# EAGLE design bufferedBackplane (EAGLE 6.6.0)
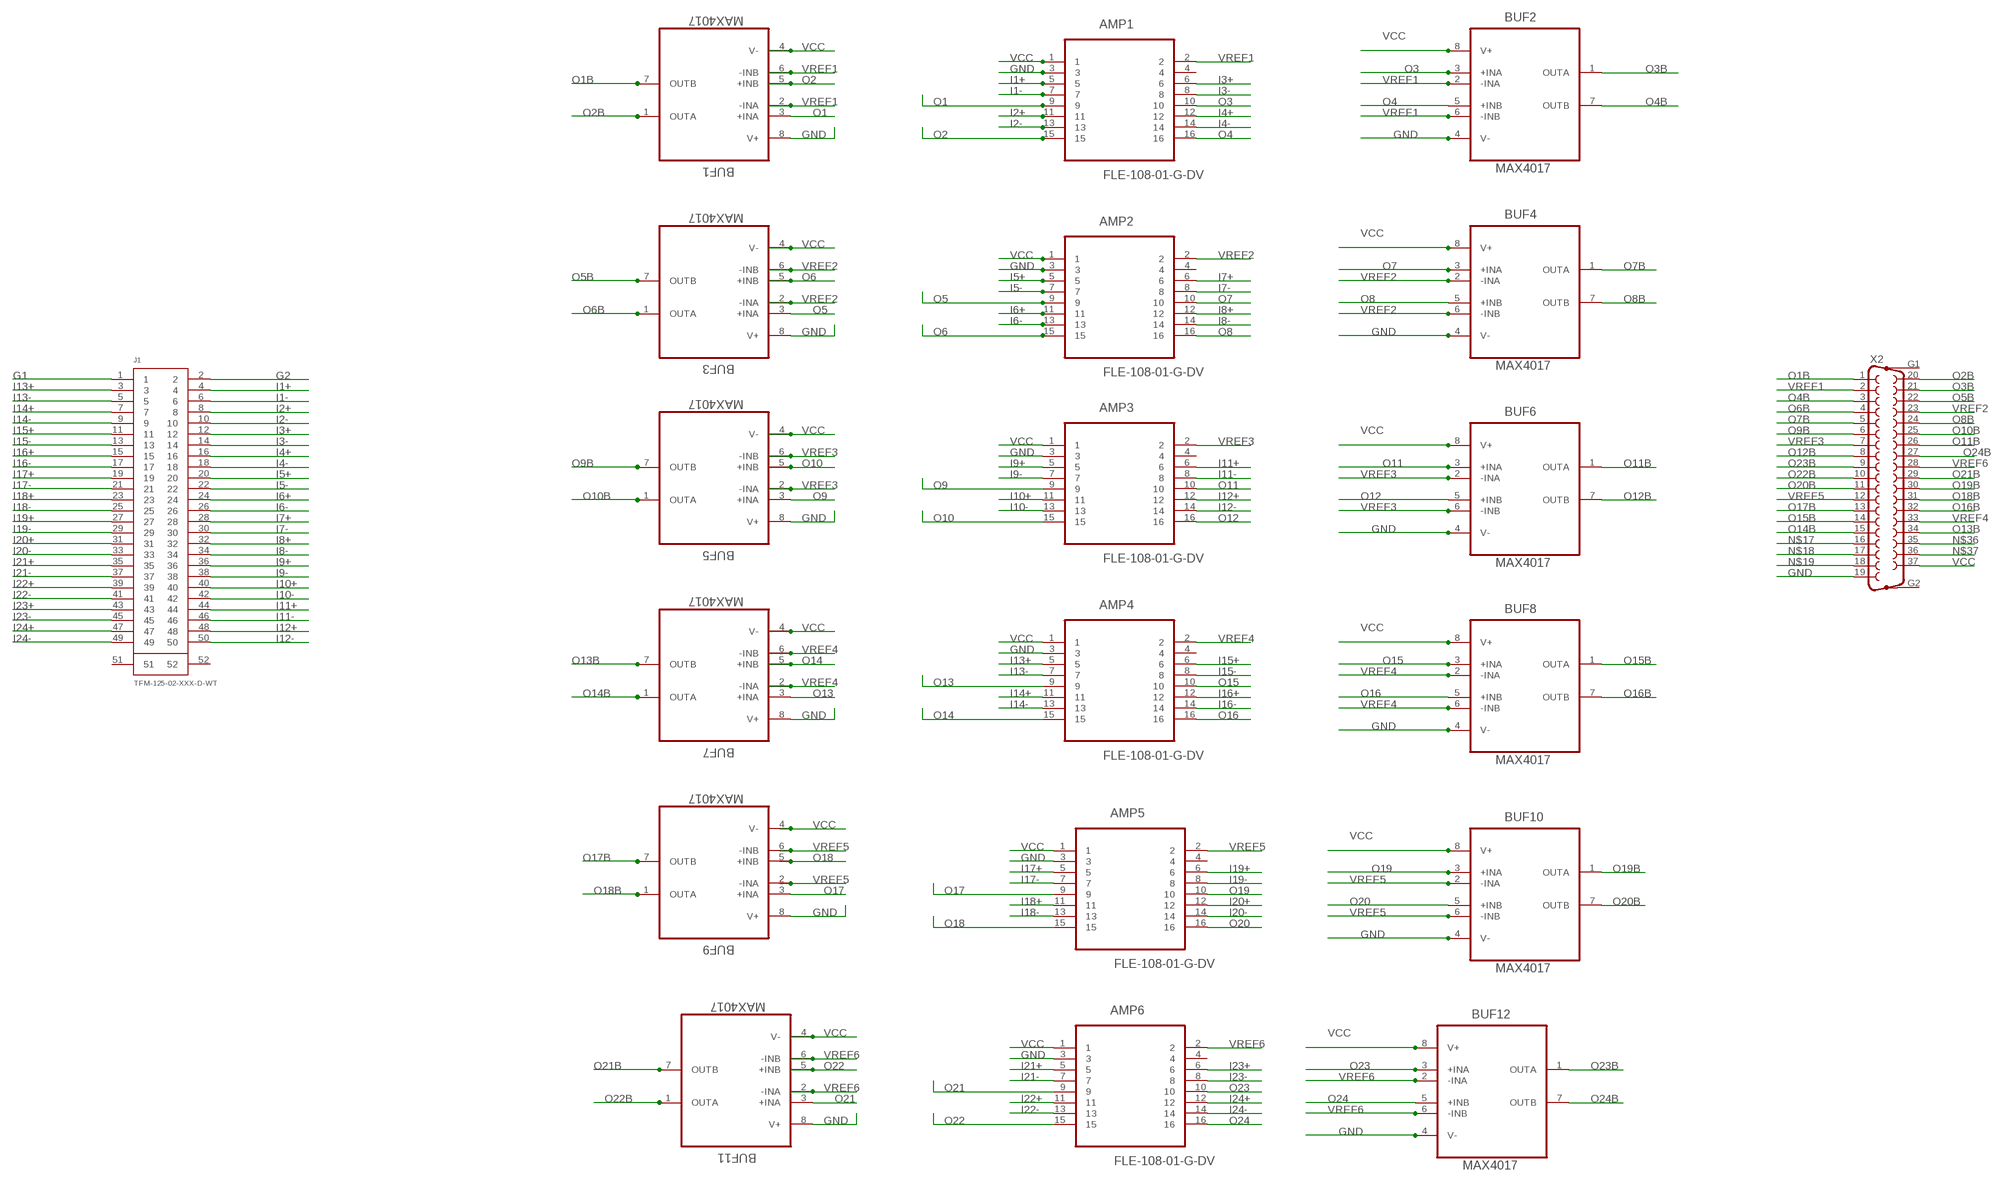
[diagram p0: schematic, sheet 1]

## Parts
AMP1  FLE-108-01-G-DV  [SAMTEC_FLE-108-01-G-DV]
AMP2  FLE-108-01-G-DV  [SAMTEC_FLE-108-01-G-DV]
AMP3  FLE-108-01-G-DV  [SAMTEC_FLE-108-01-G-DV]
AMP4  FLE-108-01-G-DV  [SAMTEC_FLE-108-01-G-DV]
AMP5  FLE-108-01-G-DV  [SAMTEC_FLE-108-01-G-DV]
AMP6  FLE-108-01-G-DV  [SAMTEC_FLE-108-01-G-DV]
BUF1  MAX4017  [MAX4017]
BUF2  MAX4017  [MAX4017]
BUF3  MAX4017  [MAX4017]
BUF4  MAX4017  [MAX4017]
BUF5  MAX4017  [MAX4017]
BUF6  MAX4017  [MAX4017]
BUF7  MAX4017  [MAX4017]
BUF8  MAX4017  [MAX4017]
BUF9  MAX4017  [MAX4017]
BUF10  MAX4017  [MAX4017]
BUF11  MAX4017  [MAX4017]
BUF12  MAX4017  [MAX4017]
J1  TFM-125-02-XXX-D-WT  [TFM-125-02-XXX-D-WT]
X2  F37HP  [F37HP]

## Nets
G1: J1.1
G2: J1.2
GND: AMP1.3 AMP2.3 AMP3.3 AMP4.3 AMP5.3 AMP6.3 BUF1.8(V+) BUF2.4(V-) BUF3.8(V+) BUF4.4(V-) BUF5.8(V+) BUF6.4(V-) BUF7.8(V+) BUF8.4(V-) BUF9.8(V+) BUF10.4(V-) BUF11.8(V+) BUF12.4(V-) X2.19
I1+: AMP1.5 J1.4
I1-: AMP1.7 J1.6
I2+: AMP1.11 J1.8
I2-: AMP1.13 J1.10
I3+: AMP1.6 J1.12
I3-: AMP1.8 J1.14
I4+: AMP1.12 J1.16
I4-: AMP1.14 J1.18
I5+: AMP2.5 J1.20
I5-: AMP2.7 J1.22
I6+: AMP2.11 J1.24
I6-: AMP2.13 J1.26
I7+: AMP2.6 J1.28
I7-: AMP2.8 J1.30
I8+: AMP2.12 J1.32
I8-: AMP2.14 J1.34
I9+: AMP3.5 J1.36
I9-: AMP3.7 J1.38
I10+: AMP3.11 J1.40
I10-: AMP3.13 J1.42
I11+: AMP3.6 J1.44
I11-: AMP3.8 J1.46
I12+: AMP3.12 J1.48
I12-: AMP3.14 J1.50
I13+: AMP4.5 J1.3
I13-: AMP4.7 J1.5
I14+: AMP4.11 J1.7
I14-: AMP4.13 J1.9
I15+: AMP4.6 J1.11
I15-: AMP4.8 J1.13
I16+: AMP4.12 J1.15
I16-: AMP4.14 J1.17
I17+: AMP5.5 J1.19
I17-: AMP5.7 J1.21
I18+: AMP5.11 J1.23
I18-: AMP5.13 J1.25
I19+: AMP5.6 J1.27
I19-: AMP5.8 J1.29
I20+: AMP5.12 J1.31
I20-: AMP5.14 J1.33
I21+: AMP6.5 J1.35
I21-: AMP6.7 J1.37
I22+: AMP6.11 J1.39
I22-: AMP6.13 J1.41
I23+: AMP6.6 J1.43
I23-: AMP6.8 J1.45
I24+: AMP6.12 J1.47
I24-: AMP6.14 J1.49
N$17: X2.16
N$18: X2.17
N$19: X2.18
N$36: X2.35
N$37: X2.36
O1: AMP1.9 BUF1.3(+INA)
O1B: BUF1.7(OUTB) X2.1
O2: AMP1.15 BUF1.5(+INB)
O2B: BUF1.1(OUTA) X2.20
O3: AMP1.10 BUF2.3(+INA)
O3B: BUF2.1(OUTA) X2.21
O4: AMP1.16 BUF2.5(+INB)
O4B: BUF2.7(OUTB) X2.3
O5: AMP2.9 BUF3.3(+INA)
O5B: BUF3.7(OUTB) X2.22
O6: AMP2.15 BUF3.5(+INB)
O6B: BUF3.1(OUTA) X2.4
O7: AMP2.10 BUF4.3(+INA)
O7B: BUF4.1(OUTA) X2.5
O8: AMP2.16 BUF4.5(+INB)
O8B: BUF4.7(OUTB) X2.24
O9: AMP3.9 BUF5.3(+INA)
O9B: BUF5.7(OUTB) X2.6
O10: AMP3.15 BUF5.5(+INB)
O10B: BUF5.1(OUTA) X2.25
O11: AMP3.10 BUF6.3(+INA)
O11B: BUF6.1(OUTA) X2.26
O12: AMP3.16 BUF6.5(+INB)
O12B: BUF6.7(OUTB) X2.8
O13: AMP4.9 BUF7.3(+INA)
O13B: BUF7.7(OUTB) X2.34
O14: AMP4.15 BUF7.5(+INB)
O14B: BUF7.1(OUTA) X2.15
O15: AMP4.10 BUF8.3(+INA)
O15B: BUF8.1(OUTA) X2.14
O16: AMP4.16 BUF8.5(+INB)
O16B: BUF8.7(OUTB) X2.32
O17: AMP5.9 BUF9.3(+INA)
O17B: BUF9.7(OUTB) X2.13
O18: AMP5.15 BUF9.5(+INB)
O18B: BUF9.1(OUTA) X2.31
O19: AMP5.10 BUF10.3(+INA)
O19B: BUF10.1(OUTA) X2.30
O20: AMP5.16 BUF10.5(+INB)
O20B: BUF10.7(OUTB) X2.11
O21: AMP6.9 BUF11.3(+INA)
O21B: BUF11.7(OUTB) X2.29
O22: AMP6.15 BUF11.5(+INB)
O22B: BUF11.1(OUTA) X2.10
O23: AMP6.10 BUF12.3(+INA)
O23B: BUF12.1(OUTA) X2.9
O24: AMP6.16 BUF12.5(+INB)
O24B: BUF12.7(OUTB) X2.27
VCC: AMP1.1 AMP2.1 AMP3.1 AMP4.1 AMP5.1 AMP6.1 BUF1.4(V-) BUF2.8(V+) BUF3.4(V-) BUF4.8(V+) BUF5.4(V-) BUF6.8(V+) BUF7.4(V-) BUF8.8(V+) BUF9.4(V-) BUF10.8(V+) BUF11.4(V-) BUF12.8(V+) X2.37
VREF1: AMP1.2 BUF1.2(-INA) BUF1.6(-INB) BUF2.2(-INA) BUF2.6(-INB) X2.2
VREF2: AMP2.2 BUF3.2(-INA) BUF3.6(-INB) BUF4.2(-INA) BUF4.6(-INB) X2.23
VREF3: AMP3.2 BUF5.2(-INA) BUF5.6(-INB) BUF6.2(-INA) BUF6.6(-INB) X2.7
VREF4: AMP4.2 BUF7.2(-INA) BUF7.6(-INB) BUF8.2(-INA) BUF8.6(-INB) X2.33
VREF5: AMP5.2 BUF9.2(-INA) BUF9.6(-INB) BUF10.2(-INA) BUF10.6(-INB) X2.12
VREF6: AMP6.2 BUF11.2(-INA) BUF11.6(-INB) BUF12.2(-INA) BUF12.6(-INB) X2.28
Unconnected: AMP1.4 AMP2.4 AMP3.4 AMP4.4 AMP5.4 AMP6.4 J1.51 J1.52 X2.G1 X2.G2

## Library data of the parts
AMP1-AMP6 = SAMTEC-FLE-Mxx-Sxx_By_element14_Batch_1:FLE-108-01-G-DV: CONN SOCKET, 1.27MM, SMT, 16WAY; MPN: FLE-108-01-G-DV; OC_FARNELL: 1929625; OC_NEWARK: 26K2845; PACKAGE: SOCKET, 1.27MM, SMT, 16WAY; SUPPLIER: SAMTEC
BUF1-BUF12 = tuckerLib:MAX4017
J1 = TFM-125-02-XXX-D-WT:TFM-125-02-XXX-D-WT: 0.050"X0.050" SURFACE MOUNT TERMINAL STRIP WITH DUAL WELD TAB.
X2 = con-subd:F37HP: SUB-D; OC_FARNELL: unknown; OC_NEWARK: unknown

## Board
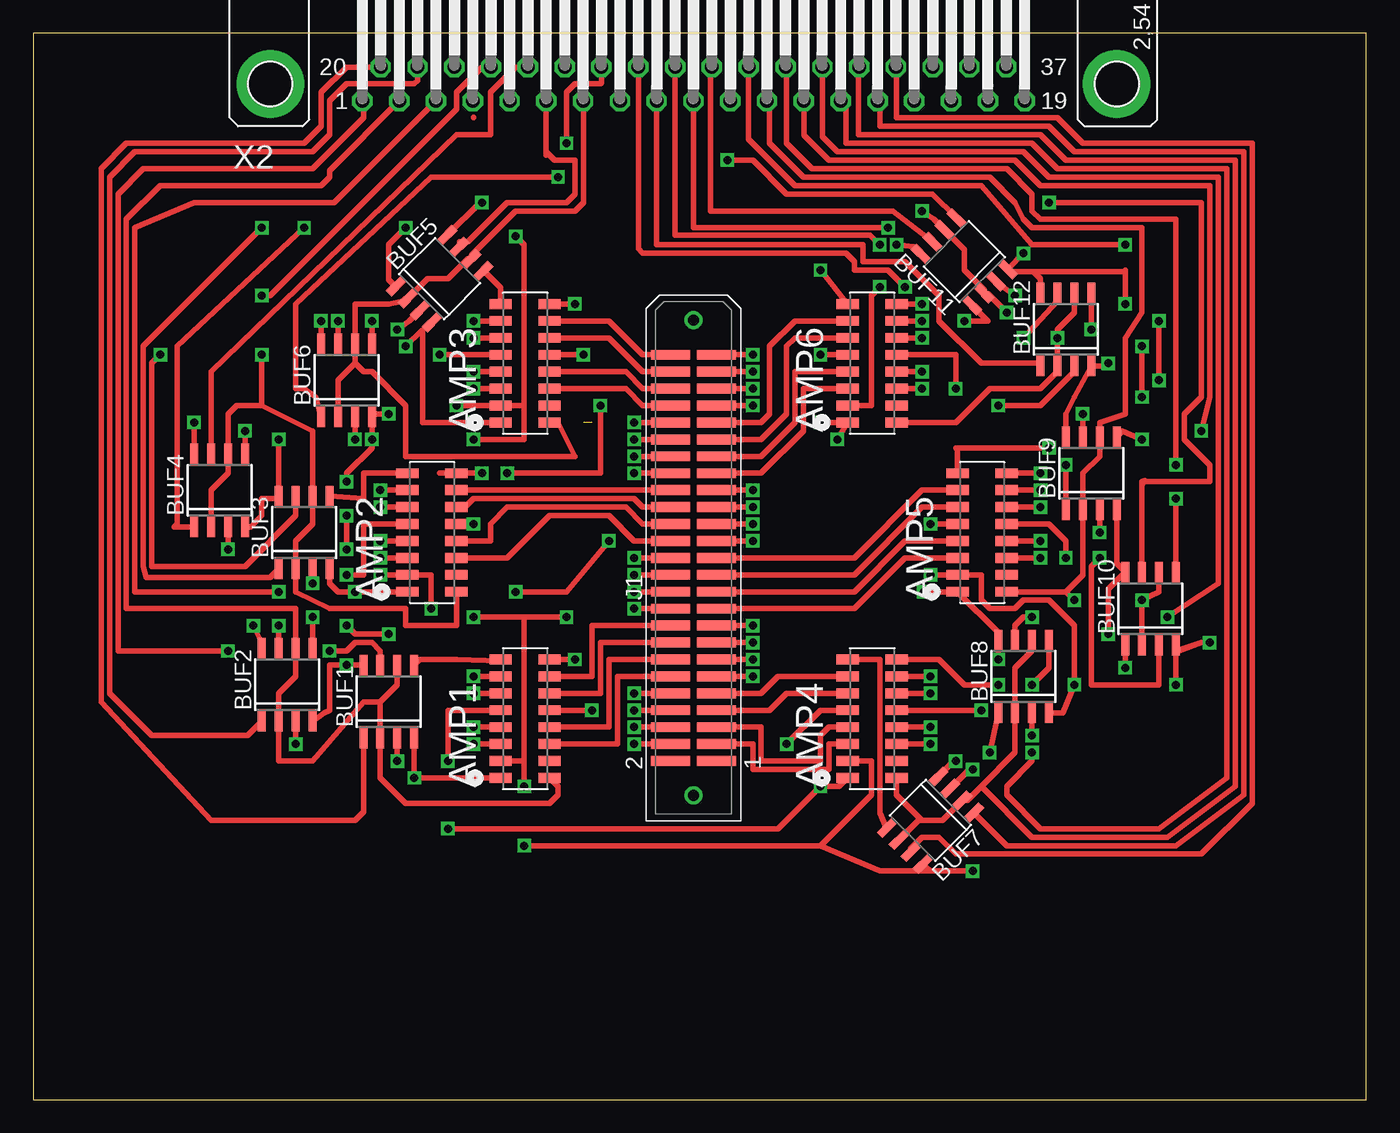
[diagram p1: board, top side]
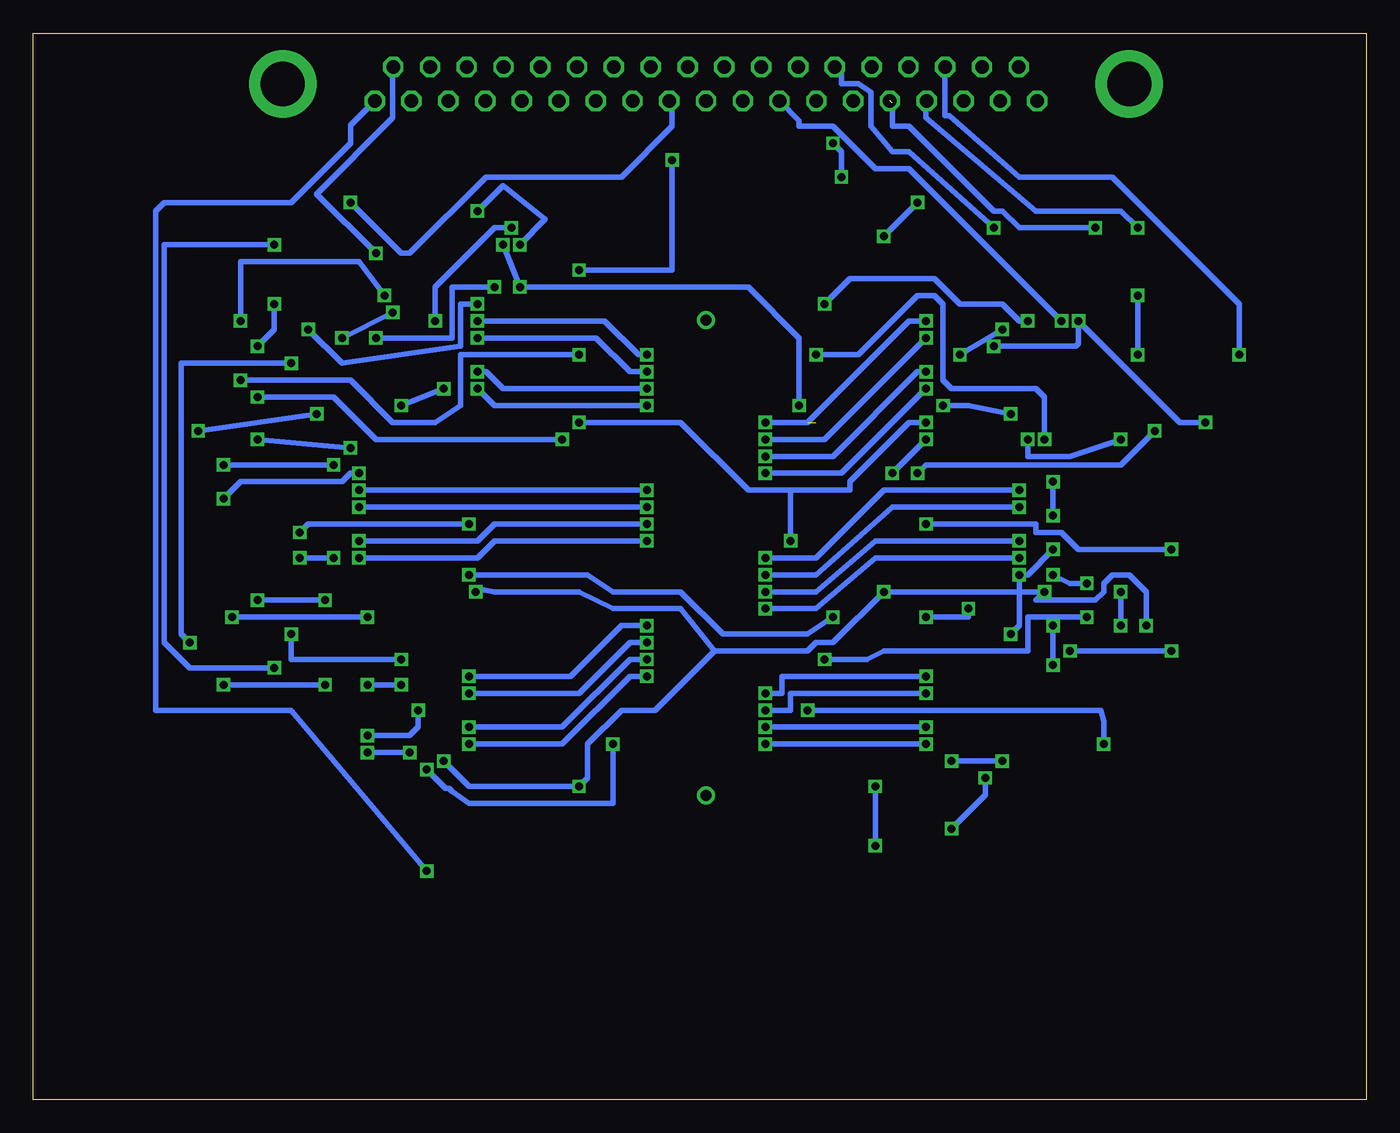
[diagram p2: board, bottom side, seen from below]

Size 100 x 80 mm. Coordinates in mm from the lower left corner, seen from the top.
Outline: 0,0 100,0 100,80 0,80 0,0
Copper layers (1*16): Top 0.035mm / dielectric 1.5mm / Bottom 0.035mm
Design rules "default": minimum track width 10mil, minimum drill 24mil, track to track 8mil, track to pad 8mil, pad to pad 8mil, via to via 8mil, smd to smd 8mil, copper to edge 40mil, drill to drill 8mil, minimum pad ring 10mil, minimum via ring 8mil, stop-mask expansion 4mil, vias tented up to drill 0mil, thermal gap 10mil

### Footprints (pad centres in the part's own frame; a part is rotated, then mirrored left to right if it is on the bottom)
SAMTEC_FLE-108-01-G-DV = smd 0.737 x 1.676: 1 -8.89,3.683; 2 -8.89,0; 3 -7.62,3.683; 4 -7.62,0; 5 -6.35,3.683; 6 -6.35,0; 7 -5.08,3.683; 8 -5.08,0; 9 -3.81,3.683; 10 -3.81,0; 11 -2.54,3.683; 12 -2.54,0; 13 -1.27,3.683; 14 -1.27,0; 15 0,3.683; 16 0,0
MAX4017 = smd 0.6 x 1.5: 1 -1.905,-2.75; 2 -0.635,-2.75; 3 0.635,-2.75; 4 1.905,-2.75; 5 1.905,2.75; 6 0.635,2.75; 7 -0.635,2.75; 8 -1.905,2.75
TFM-125-02-XXX-D-WT = smd 0.737 x 2.921: 1 -15.24,-1.714; 2 -15.24,1.714; 3 -13.97,-1.714; 4 -13.97,1.714; 5 -12.7,-1.714; 6 -12.7,1.714; 7 -11.43,-1.714; 8 -11.43,1.714; 9 -10.16,-1.714; 10 -10.16,1.714; 11 -8.89,-1.714; 12 -8.89,1.714; 13 -7.62,-1.714; 14 -7.62,1.714; 15 -6.35,-1.714; 16 -6.35,1.714; 17 -5.08,-1.714; 18 -5.08,1.714; 19 -3.81,-1.714; 20 -3.81,1.714; 21 -2.54,-1.714; 22 -2.54,1.714; 23 -1.27,-1.714; 24 -1.27,1.714; 25 0,-1.714; 26 0,1.714; 27 1.27,-1.714; 28 1.27,1.714; 29 2.54,-1.714; 30 2.54,1.714; 31 3.81,-1.714; 32 3.81,1.714; 33 5.08,-1.714; 34 5.08,1.714; 35 6.35,-1.714; 36 6.35,1.714; 37 7.62,-1.714; 38 7.62,1.714; 39 8.89,-1.714; 40 8.89,1.714; 41 10.16,-1.714; 42 10.16,1.714; 43 11.43,-1.714; 44 11.43,1.714; 45 12.7,-1.714; 46 12.7,1.714; 47 13.97,-1.714; 48 13.97,1.714; 49 15.24,-1.714; 50 15.24,1.714 | drill 0.838: 51 -17.831,0; 52 17.831,0
F37HP = drill 1.016 octagon: 1 -24.841,-1.27; 2 -22.073,-1.27; 3 -19.329,-1.27; 4 -16.561,-1.27; 5 -13.792,-1.27; 6 -11.049,-1.27; 7 -8.28,-1.27; 8 -5.512,-1.27; 9 -2.769,-1.27; 10 0,-1.27; 11 2.769,-1.27; 12 5.512,-1.27; 13 8.28,-1.27; 14 11.049,-1.27; 15 13.818,-1.27; 16 16.561,-1.27; 17 19.329,-1.27; 18 22.098,-1.27; 19 24.841,-1.27; 20 -23.47,1.27; 21 -20.701,1.27; 22 -17.932,1.27; 23 -15.189,1.27; 24 -12.421,1.27; 25 -9.652,1.27; 26 -6.909,1.27; 27 -4.14,1.27; 28 -1.372,1.27; 29 1.372,1.27; 30 4.14,1.27; 31 6.909,1.27; 32 9.677,1.27; 33 12.421,1.27; 34 15.189,1.27; 35 17.958,1.27; 36 20.701,1.27; 37 23.47,1.27 | drill 3.302 pad 5.08: G1 -31.75,0; G2 31.75,0

### Placement (x,y rotation side)
AMP1  38.73,33.02 90 top
AMP2  31.75,46.99 90 top
AMP3  38.73,59.69 90 top
AMP4  64.77,33.02 90 top
AMP5  73.03,46.99 90 top
AMP6  64.77,59.69 90 top
BUF1  26.67,29.84 0 top
BUF2  19.05,31.11 0 top
BUF3  20.32,42.55 0 top
BUF4  13.97,45.72 0 top
BUF5  30.48,61.59 315 top
BUF6  23.5,53.98 0 top
BUF7  67.31,20.95 135 top
BUF8  74.3,31.75 0 top
BUF9  79.38,46.99 0 top
BUF10  83.82,36.83 0 top
BUF11  69.85,62.87 45 top
BUF12  77.47,57.78 0 top
J1  49.53,40.64 90 top
X2  49.53,76.2 0 top

### Tracks (layer width: path | path; a pad name or v marks a point on that pad's centre or on a via)
GND  (via drill 0.6)
  Top 0.406: v31.75,52.07 AMP3.3 36.83,52.07 | v26.67,51.44 25.61,51.44 BUF6.4 v25.4,49.53 25.4,48.9 23.5,46.99 v23.5,46.35 | BUF7.8 67.31,17.14 v70.48,17.14 63.5,17.14 59.05,19.05 | BUF2.4 21.8,29 22.23,29.21 22.23,32.59 v23.5,32.59 BUF1.8 | 36.83,52.07 36.83,64.14 v36.2,64.77 | v33.66,67.31 33.5,67.31 BUF5.8 | BUF4.4 16.3,42.97 17.14,43.81 17.14,45.09 18.2,45.09 BUF3.8 v18.41,49.53 | AMP6.3 62.87,52.07 62.87,60.33 v63.5,60.96 | v64.77,64.14 66.04,63.98 BUF11.8 | 36.83,52.07 36.83,49.53 v33.02,49.53 | v35.56,46.99 42.55,46.99 v42.55,52.07 | v67.31,39.37 AMP5.3 71.12,39.37 71.12,37.47 71.75,36.83 73.66,36.83 74.3,37.47 76.2,37.47 78.11,35.56 v78.11,31.11 77.26,29 BUF8.4 | v40.01,36.2 36.83,36.2 | 36.83,36.2 36.83,25.4 | 36.83,25.4 AMP1.3 | 36.83,36.2 v33.02,36.2 | v29.84,36.83 29.84,39.37 AMP2.3 v26.04,39.37 | v26.67,34.92 24.13,34.92 v23.5,35.56 | 36.83,25.4 v36.83,23.5 | v36.83,19.05 59.05,19.05 | 59.05,19.05 62.87,22.86 62.87,25.4 AMP4.3 | v88.27,34.29 87.63,34.29 | 87.63,34.29 85.94,33.66 BUF10.4 85.72,33.66 | v85.72,31.11 85.72,33.66 | 85.72,33.66 87.63,34.29 | BUF9.8 77.47,51.44 78.11,52.7 BUF12.4 80.22,55.03 v80.64,55.24 | v23.5,41.27 v23.5,43.81
  Bottom 0.406: v31.75,52.07 29.84,52.07 v26.67,51.44 | v70.48,17.14 80.64,29.21 90.81,29.21 90.81,66.67 90.17,67.31 80.64,67.31 76.2,71.75 76.2,73.1 X2.19 | v36.2,64.77 v33.66,67.31 | v18.41,49.53 22.23,48.26 25.4,48.26 v25.4,49.53 | v64.77,64.14 v63.5,60.96 46.35,60.96 42.55,57.15 v42.55,52.07 | v33.02,49.53 v35.56,46.99 | v67.31,39.37 58.42,39.37 56.52,38.1 51.44,38.1 48.26,34.92 41.91,34.92 v40.01,36.2 | v33.02,36.2 29.84,36.2 v29.84,36.83 | v26.67,34.92 26.04,35.56 v26.04,39.37 25.4,39.37 v23.5,41.27 | v23.5,35.56 v23.5,32.59 | v36.83,23.5 v36.83,19.05 | v88.27,34.29 88.9,34.92 88.9,55.24 v80.64,55.24 | v78.11,31.11 v85.72,31.11 | v23.5,43.81 v23.5,46.35
I1+  (via drill 0.6)
  Top 0.406: J1.4 v45.09,26.67 | v33.02,26.67 AMP1.5
  Bottom 0.406: v45.09,26.67 v33.02,26.67
I1-  (via drill 0.6)
  Top 0.406: J1.6 v45.09,27.94 | v33.02,27.94 AMP1.7
  Bottom 0.406: v45.09,27.94 v33.02,27.94
I2+  (via drill 0.6)
  Top 0.406: J1.8 v45.09,29.21 | AMP1.11 v33.02,30.48
  Bottom 0.406: v45.09,29.21 43.18,29.21 43.18,30.48 v33.02,30.48
I2-  (via drill 0.6)
  Top 0.406: J1.10 v45.09,30.48 | v33.02,31.75 AMP1.13
  Bottom 0.406: v45.09,30.48 43.81,30.48 43.81,31.75 v33.02,31.75
I3+
  Top 0.406: J1.12 43.81,31.75 43.81,26.67 AMP1.6
I3-
  Top 0.406: J1.14 43.18,33.02 43.18,27.94 AMP1.8
I4+
  Top 0.406: J1.16 42.55,34.29 42.55,30.48 AMP1.12
I4-
  Top 0.406: J1.18 41.91,35.56 41.91,31.75 AMP1.14
I5+  (via drill 0.6)
  Top 0.406: J1.20 v45.09,36.83 | v26.04,40.64 AMP2.5
  Bottom 0.406: v45.09,36.83 41.27,36.83 36.83,40.64 v26.04,40.64
I5-  (via drill 0.6)
  Top 0.406: J1.22 v45.09,38.1 | v26.04,41.91 AMP2.7
  Bottom 0.406: v45.09,38.1 41.27,38.1 36.83,41.91 v26.04,41.91
I6+  (via drill 0.6)
  Top 0.406: J1.24 v45.09,39.37 | v26.04,44.45 AMP2.11
  Bottom 0.406: v45.09,39.37 41.27,39.37 35.56,44.45 v26.04,44.45
I6-  (via drill 0.6)
  Top 0.406: J1.26 v45.09,40.64 | v26.04,45.72 AMP2.13
  Bottom 0.406: v45.09,40.64 41.27,40.64 36.2,45.72 v26.04,45.72
I7+
  Top 0.406: AMP2.6 35.56,40.64 38.73,43.81 43.18,43.81 45.09,41.91 J1.28
I7-
  Top 0.406: AMP2.8 34.29,41.91 34.29,43.18 35.56,44.45 44.45,44.45 45.72,43.18 J1.30
I8+
  Top 0.406: AMP2.12 32.38,44.45 33.02,45.09 45.09,45.09 45.72,44.45 J1.32
I8-
  Top 0.406: J1.34 AMP2.14
I9+  (via drill 0.6)
  Top 0.406: J1.36 v45.09,46.99 | v33.02,53.34 AMP3.5
  Bottom 0.406: v45.09,46.99 39.37,46.99 v33.02,53.34
I9-  (via drill 0.6)
  Top 0.406: J1.38 v45.09,48.26 | v33.02,54.61 AMP3.7
  Bottom 0.406: v33.02,54.61 33.66,54.61 40.01,48.26 v45.09,48.26
I10+  (via drill 0.6)
  Top 0.406: J1.40 v45.09,49.53 | v33.02,57.15 AMP3.11
  Bottom 0.406: v45.09,49.53 40.64,49.53 v33.02,57.15
I10-  (via drill 0.6)  (1 unrouted)
  Top 0.406: J1.42 v45.09,50.8 | v33.02,58.42 AMP3.13
  Bottom 0.406: v45.09,50.8 41.91,50.8 34.29,58.42 v33.02,58.42
I11+
  Top 0.406: J1.44 45.72,52.07 44.45,53.34 AMP3.6
I11-
  Top 0.406: J1.46 45.72,53.34 44.45,54.61 AMP3.8
I12+
  Top 0.406: J1.48 45.72,54.61 43.18,57.15 AMP3.12
I12-
  Top 0.406: J1.50 45.72,55.88 43.18,58.42 AMP3.14
I13+
  Top 0.406: J1.3 53.98,26.67 53.98,24.77 59.69,24.77 59.69,26.67 AMP4.5
I13-
  Top 0.406: J1.5 54.61,27.94 54.61,25.4 59.05,25.4 59.05,27.3 59.69,27.94 AMP4.7
I14+
  Top 0.406: J1.7 55.24,29.21 56.52,30.48 AMP4.11
I14-
  Top 0.406: J1.9 54.61,30.48 55.88,31.75 AMP4.13
I15+  (via drill 0.6)
  Top 0.406: J1.11 v53.98,31.75 | v67.31,26.67 AMP4.6
  Bottom 0.406: v53.98,31.75 55.24,31.75 60.33,26.67 v67.31,26.67
I15-  (via drill 0.6)
  Top 0.406: J1.13 v53.98,33.02 | v67.31,27.94 AMP4.8
  Bottom 0.406: v53.98,33.02 55.24,33.02 60.33,27.94 v67.31,27.94
I16+  (via drill 0.6)
  Top 0.406: J1.15 v53.98,34.29 | v67.31,30.48 AMP4.12
  Bottom 0.406: v53.98,34.29 55.24,34.29 59.05,30.48 v67.31,30.48
I16-  (via drill 0.6)
  Top 0.406: J1.17 v53.98,35.56 | v67.31,31.75 AMP4.14
  Bottom 0.406: v53.98,35.56 55.88,35.56 59.69,31.75 v67.31,31.75
I17+
  Top 0.406: J1.19 61.59,36.83 65.41,40.64 AMP5.5
I17-
  Top 0.406: J1.21 61.59,38.1 65.41,41.91 AMP5.7
I18+
  Top 0.406: J1.23 61.59,39.37 66.67,44.45 AMP5.11
I18-
  Top 0.406: J1.25 61.59,40.64 66.67,45.72 AMP5.13
I19+  (via drill 0.6)
  Top 0.406: J1.27 v53.98,41.91 | v75.56,40.64 AMP5.6
  Bottom 0.406: v53.98,41.91 65.41,41.91 66.67,40.64 v75.56,40.64
I19-  (via drill 0.6)
  Top 0.406: J1.29 v53.98,43.18 | v75.56,41.91 AMP5.8
  Bottom 0.406: v75.56,41.91 66.67,41.91 65.41,43.18 v53.98,43.18
I20+  (via drill 0.6)
  Top 0.406: J1.31 v53.98,44.45 | v75.56,44.45 AMP5.12
  Bottom 0.406: v53.98,44.45 v75.56,44.45
I20-  (via drill 0.6)
  Top 0.406: J1.33 v53.98,45.72 | v75.56,45.72 AMP5.14
  Bottom 0.406: v53.98,45.72 v75.56,45.72
I21+
  Top 0.406: J1.35 54.61,46.99 57.78,50.16 57.78,53.34 AMP6.5
I21-
  Top 0.406: J1.37 54.61,48.26 57.15,50.8 57.15,54.61 AMP6.7
I22+
  Top 0.406: J1.39 54.61,49.53 56.52,51.44 56.52,56.52 57.15,57.15 AMP6.11
I22-
  Top 0.406: J1.41 54.61,50.8 55.24,51.44 55.24,56.52 57.15,58.42 AMP6.13
I23+  (via drill 0.6)
  Top 0.406: J1.43 v53.98,52.07 | v66.67,53.34 AMP6.6
  Bottom 0.406: v53.98,52.07 65.41,52.07 v66.67,53.34
I23-  (via drill 0.6)
  Top 0.406: J1.45 v53.98,53.34 | v66.67,54.61 AMP6.8
  Bottom 0.406: v53.98,53.34 64.77,53.34 66.04,54.61 v66.67,54.61
I24+  (via drill 0.6)
  Top 0.406: J1.47 v53.98,54.61 | v66.67,57.15 AMP6.12
  Bottom 0.406: v53.98,54.61 55.24,54.61 57.78,57.15 v66.67,57.15
I24-  (via drill 0.6)
  Top 0.406: J1.49 v53.98,55.88 | v66.67,58.42 AMP6.14
  Bottom 0.406: v53.98,55.88 54.61,55.88 57.15,58.42 v66.67,58.42
O1  (via drill 0.6)
  Top 0.406: BUF1.3 v27.3,25.4 | v31.11,25.4 31.11,29.21 AMP1.9
  Bottom 0.406: v27.3,25.4 v31.11,25.4
O1B  (via drill 0.6)
  Top 0.406: BUF1.7 26.04,33.66 25.4,34.29 24.13,34.29 23.5,33.66 v22.23,33.66 | v14.61,33.66 6.35,33.66 6.35,67.94 8.26,69.85 20.95,69.85 24.77,73.66 24.77,74.85 X2.1
  Bottom 0.406: v22.23,33.66 v14.61,33.66
O2
  Top 0.406: AMP1.15 35.05,32.89 31.75,33.02 29,33.02 BUF1.5
O2B
  Top 0.406: X2.20 23.5,77.47 21.59,75.56 21.59,73.03 20.32,71.75 6.99,71.75 5.08,69.85 5.08,29.84 13.34,20.95 24.13,20.95 24.77,21.59 BUF1.1
O3  (via drill 0.6)
  Top 0.406: AMP1.10 v41.91,29.21 | v19.68,26.67 BUF2.3
  Bottom 0.406: v41.91,29.21 19.89,29.21 BUF2.3 v19.68,26.67
O3B
  Top 0.406: X2.21 28.83,76.45 28.57,76.2 23.5,76.2 22.23,74.93 22.23,72.39 20.95,71.12 7.62,71.12 5.71,69.22 5.71,30.48 8.89,27.3 16.09,27.3 BUF2.1
O4  (via drill 0.6)
  Top 0.406: BUF2.5 v20.95,36.2 | v40.64,33.02 AMP1.16
  Bottom 0.406: v40.64,33.02 37.47,33.02 36.2,33.66 25.4,33.66 25.4,36.2 v20.95,36.2
O4B  (via drill 0.6)
  Top 0.406: BUF2.7 v18.41,35.56 | v18.41,38.1 7.62,38.1 7.62,65.41 12.06,67.31 22.58,67.31 X2.3
  Bottom 0.406: v18.41,35.56 v18.41,38.1
O5  (via drill 0.6)
  Top 0.406: BUF3.3 v20.95,38.73 | v23.5,39.37 24.77,39.37 24.77,43.18 AMP2.9
  Bottom 0.406: v20.95,38.73 22.23,38.73 v23.5,39.37
O5B  (via drill 0.6)
  Top 0.406: BUF3.7 19.68,43.81 15.88,40.01 8.89,40.01 8.89,55.24 v9.53,55.88
  Bottom 0.406: v9.53,55.88 9.53,59.69 19.05,69.22 26.04,69.22 31.27,73.81 31.6,73.81 X2.22
O6
  Top 0.406: BUF3.5 24.77,45.09 24.77,46.99 AMP2.15
O6B  (via drill 0.6)  (1 unrouted)
  Top 0.406: v17.14,65.41 8.26,56.52 8.26,40.01 8.46,39.16 17.78,39.16 BUF3.1 | 33.02,73.66 33.02,73.71
  Bottom 0.406: v17.14,65.41 18.41,66.67 24.77,66.67 33.02,73.66 33.02,74.88 X2.4
O7  (via drill 0.6)
  Top 0.406: BUF4.3 v14.61,41.27 | v33.02,43.18 AMP2.10
  Bottom 0.406: v33.02,43.18 24.77,43.18 24.77,42.55 22.86,42.55 21.59,41.27 v14.61,41.27
O7B  (via drill 0.6)  (1 unrouted)
  Top 0.406: BUF4.1 10.59,42.97 10.79,43.18 10.79,56.52 v20.32,65.41
  Bottom 0.406: v20.32,65.41 26.04,65.41 27.3,66.67 27.94,66.67 34.29,73.03 35.56,73.03 35.56,74.75 X2.5
O8  (via drill 0.6)
  Top 0.406: 30.48,46.99 AMP2.16 v33.66,46.99 | v15.88,50.16 BUF4.5
  Bottom 0.406: v15.88,50.16 18.41,47.62 33.02,47.62 v33.66,46.99
O8B
  Top 0.406: BUF4.7 13.34,54.61 31.75,72.39 34.29,72.39 34.29,75.56 36.2,77.47 X2.24
O9  (via drill 0.6)
  Top 0.406: AMP3.9 v30.48,55.88 | v27.3,57.78 28.2,58.42 BUF5.3
  Bottom 0.406: v30.48,55.88 v27.3,57.78
O9B
  Top 0.406: X2.6 38.48,71.12 | 38.48,71.12 38.48,70.87 | BUF5.7 31.98,64.36 32.61,64.36 35.56,67.31 40.01,67.31 40.64,67.94 40.64,70.48 39.12,70.48 38.48,71.12
O10
  Top 0.406: AMP3.15 35.05,60.91 BUF5.5
O10B  (via drill 0.6)
  Top 0.406: v27.94,65.41 26.67,64.14 26.67,61.52 BUF5.1
  Bottom 0.406: v27.94,65.41 34.29,71.12 35.56,71.12 37.15,73.03 37.15,75.56 38.1,76.2 39.37,76.2 39.37,76.96 X2.25
O11  (via drill 0.6)
  Top 0.406: AMP3.10 v41.27,55.88 | v24.13,49.53 BUF6.3
  Bottom 0.406: v41.27,55.88 38.1,55.88 33.66,60.33 32.38,60.33 31.75,59.69 31.75,53.98 31.11,53.34 24.77,53.34 24.13,52.7 v24.13,49.53
O11B  (via drill 0.6)
  Top 0.406: X2.26 42.62,76.28 42.55,76.2 40.64,76.2 40.01,75.56 v40.01,71.75 | v39.37,69.22 29.84,69.22 19.68,59.69 19.68,53.34 20.32,53.34 21.16,52.7 BUF6.1
  Bottom 0.406: v40.01,71.75 39.37,71.12 v39.37,69.22
O12  (via drill 0.6)
  Top 0.406: BUF6.5 v25.4,58.42 | v40.64,59.69 AMP3.16
  Bottom 0.406: v25.4,58.42 26.04,58.42 27.3,59.69 30.48,59.69 32.38,61.59 38.73,61.59 v40.64,59.69
O12B  (via drill 0.6)
  Top 0.406: X2.8 44.02,74.5 | v22.86,58.42 BUF6.7
  Bottom 0.406: X2.8 42.55,73.46 42.55,73.03 40.01,73.03 36.83,69.85 34.29,69.85 v22.86,58.42
O13  (via drill 0.6)
  Top 0.406: AMP4.9 59.05,29.21 v56.52,26.67 | v70.48,24.77 70.22,24.77 BUF7.3
  Bottom 0.406: v56.52,26.67 56.52,22.23 67.31,22.23 68.58,23.12 BUF7.3 69.07,23.35 v70.48,24.77
O13B
  Top 0.406: BUF7.7 65.81,18.82 66.67,19.68 67.94,19.68 69.22,18.41 87.63,18.41 91.44,22.23 91.44,71.75 78.74,71.75 76.83,73.66 64.77,73.66 64.77,77.42 X2.34
O14
  Top 0.406: AMP4.15 63.5,33.02 63.5,21.51 BUF7.5
O14B
  Top 0.406: BUF7.1 70.6,21.47 73.03,19.05 85.72,19.05 90.81,22.86 90.81,71.12 78.11,71.12 76.2,73.03 63.5,73.03 63.5,74.78 X2.15
O15  (via drill 0.6)
  Top 0.406: AMP4.10 v71.12,29.21 | v74.93,27.3 BUF8.3
  Bottom 0.406: v71.12,29.21 71.12,27.94 71.75,27.3 v74.93,27.3
O15B  (via drill 0.6)
  Top 0.406: BUF8.1 v71.75,26.04 | v74.93,26.04 74.93,25.4 73.03,23.5 73.03,22.86 75.56,20.32 84.45,20.32 89.53,24.13 89.53,69.85 76.83,69.85 74.93,71.75 60.96,71.75 60.96,74.55 X2.14
  Bottom 0.406: v71.75,26.04 v74.93,26.04
O16  (via drill 0.6)
  Top 0.406: BUF8.5 76.2,32.38 v74.93,31.11 | v72.39,31.11 69.85,31.11 67.94,33.02 AMP4.16
  Bottom 0.406: v74.93,31.11 v72.39,31.11
O16B  (via drill 0.6)
  Top 0.406: X2.32 59.21,72.24 60.33,71.12 74.3,71.12 76.2,69.22 88.9,69.22 88.9,38.73 v85.09,36.2 | BUF8.7 73.66,35.56 74.3,36.2 v74.93,36.2
  Bottom 0.406: v85.09,36.2 v74.93,36.2
O17  (via drill 0.6)
  Top 0.406: AMP5.9 v67.31,43.18 | v80.01,42.55 BUF9.3
  Bottom 0.406: v80.01,42.55 79.38,43.18 v67.31,43.18
O17B  (via drill 0.6)
  Top 0.406: X2.13 57.81,72.36 59.69,70.48 73.66,70.48 75.56,68.58 88.27,68.58 88.27,52.7 v87.63,50.16 | v78.74,51.44 BUF9.7
  Bottom 0.406: v87.63,50.16 v78.74,51.44
O18  (via drill 0.6)
  Top 0.406: AMP5.15 69.34,48.77 69.22,48.9 v76.2,48.9 | v83.19,49.53 81.7,50.16 BUF9.5
  Bottom 0.406: v76.2,48.9 v83.19,49.53
O18B  (via drill 0.6)
  Top 0.406: BUF9.1 v77.47,47.62 | X2.31 56.52,77.39 56.52,71.75 58.42,69.85 73.03,69.85 74.93,67.94 74.93,66.67 75.56,66.04 85.72,66.04 v85.72,47.62
  Bottom 0.406: v77.47,47.62 v85.72,47.62
O19  (via drill 0.6)
  Top 0.406: 84.45,34.29 BUF10.3 84.45,31.11 79.38,31.11 79.38,40.01 v80.01,40.64 | v77.47,40.64 77.47,41.91 76.2,43.18 AMP5.10
  Bottom 0.406: v80.01,40.64 v77.47,40.64
O19B  (via drill 0.6)
  Top 0.406: BUF10.1 v81.92,32.38 | v81.92,64.14 74.93,64.14 71.12,68.58 57.15,68.58 53.66,72.07 53.66,77.14 X2.30
  Bottom 0.406: v81.92,32.38 88.27,32.38 90.17,34.29 90.17,64.14 v81.92,64.14
O20  (via drill 0.6)
  Top 0.406: BUF10.5 v85.72,45.09 | v75.56,46.99 AMP5.16
  Bottom 0.406: v85.72,45.09 84.45,46.35 76.83,46.35 76.2,46.99 v75.56,46.99
O20B  (via drill 0.6)
  Top 0.406: BUF10.7 83.19,46.03 | 83.19,46.35 83.4,46.44 83.19,46.03 | v76.2,67.31 87.63,67.31 87.63,52.7 86.36,51.44 86.36,49.53 88.27,47.62 88.27,46.35 83.19,46.35 | 52.07,74.7 X2.11 | 83.19,46.35 83.19,46.03
  Bottom 0.406: v76.2,67.31 72.39,63.5 71.75,63.5 66.04,69.22 55.88,69.22 52.07,73.03 52.07,74.7 X2.11
O21  (via drill 0.6)
  Top 0.406: AMP6.9 v59.05,55.88 | v84.45,53.98 v84.45,58.42 | v73.66,60.33 72.39,61.22 BUF11.3
  Bottom 0.406: v59.05,55.88 67.94,55.88 67.94,52.07 69.85,50.8 73.03,50.8 76.2,53.98 v84.45,53.98 | v84.45,58.42 84.45,62.87 75.56,62.87 v73.66,60.33
O21B
  Top 0.406: X2.29 50.8,77.47 50.8,66.67 64.51,66.67 BUF11.7
O22  (via drill 0.6)
  Top 0.406: AMP6.15 59.18,62.1 v59.05,62.23 | BUF11.5 67.46,67.94 56.52,67.94 53.98,70.48 v52.07,70.48
  Bottom 0.406: v59.05,62.23 52.07,62.23 v52.07,70.48
O22B  (via drill 0.6)
  Top 0.406: X2.10 49.53,65.41 v64.14,65.41 | v69.85,58.42 71.6,58.42 BUF11.1
  Bottom 0.406: v64.14,65.41 65.41,65.41 69.85,60.96 v69.85,58.42
O23  (via drill 0.6)
  Top 0.406: AMP6.10 69.22,55.88 v69.22,53.34 | v72.39,52.07 75.56,52.07 78.11,54.61 BUF12.3
  Bottom 0.406: v69.22,53.34 v72.39,52.07
O23B
  Top 0.406: X2.9 46.76,64.14 62.23,64.14 62.23,62.87 65.41,62.87 67.94,60.33 67.94,58.42 71.12,55.24 75.36,55.24 BUF12.1
O24  (via drill 0.6)
  Top 0.406: AMP6.16 v66.67,59.69 | v79.38,57.78 BUF12.5
  Bottom 0.406: v66.67,59.69 67.94,59.69 67.94,56.52 76.83,55.24 v79.38,57.78
O24B  (via drill 0.6)
  Top 0.406: X2.27 45.39,63.83 45.72,63.5 60.96,63.5 61.59,62.87 61.59,62.23 64.14,62.23 v65.41,60.96 | v74.3,57.15 76.83,59.9 BUF12.7
  Bottom 0.406: v65.41,60.96 68.58,60.96 68.58,57.15 v74.3,57.15
VCC  (via drill 0.6)
  Top 0.406: BUF3.4 22.23,38.73 22.86,38.1 v24.13,38.1 AMP2.1 | BUF9.4 81.28,40.22 BUF10.8 80.64,38.31 v80.64,34.92 | 29.21,57.71 29.21,50.8 v33.02,50.8 AMP3.1 | 29.21,57.71 BUF5.4 | v66.8,38.1 AMP5.1 72.39,35.05 BUF8.8 v72.39,33.02 | v59.05,50.8 AMP6.1 v60.33,49.53 | AMP1.1 v28.57,24.13 BUF1.4 | BUF4.8 v12.06,50.8 | v21.59,58.42 BUF6.8 | 29.21,57.71 29.13,57.71 v27.94,56.52 | BUF2.8 17.14,34.29 v16.51,35.56 | v36.2,38.1 40.01,38.1 v43.18,41.91 | AMP4.1 60.45,23.5 v59.05,23.5 55.88,20.32 v31.11,20.32 | v69.22,25.4 69.06,25.4 BUF7.4 | v74.3,63.5 73.14,62.35 BUF11.4 73.14,62.11 75.05,62.11 | v83.19,52.7 v83.19,56.52 | 75.05,62.11 75.56,61.59 BUF12.8 | 75.05,62.11 81.8,62.11 81.92,62.23 v81.92,59.69
  Bottom 0.406: 48.9,33.66 41.91,33.66 41.27,34.29 40.01,34.29 v36.2,38.1 v24.13,38.1 24.77,37.47 20.32,37.47 19.68,38.1 19.68,38.73 19.05,39.37 17.78,39.37 16.51,38.1 v16.51,35.56 | v59.05,50.8 51.44,50.8 46.35,45.72 43.18,45.72 | 43.18,45.72 38.73,45.72 38.73,46.35 34.29,50.8 v33.02,50.8 | v12.06,50.8 13.97,50.8 v21.59,58.42 BUF6.8 21.8,56.52 v27.94,56.52 | v43.18,41.91 43.18,45.72 | 48.9,33.66 53.34,29.21 55.88,29.21 58.42,26.67 58.42,24.13 v59.05,23.5 67.31,23.5 v69.22,25.4 | v66.8,38.1 66.17,38.23 65.41,38.1 59.05,38.1 56.52,36.83 51.44,36.83 48.9,33.66 | v28.57,24.13 28.57,22.86 v31.11,20.32 | v74.3,63.5 78.74,67.94 73.03,73.66 73.03,77.44 X2.37 | v72.39,33.02 80.64,33.02 v80.64,34.92 | v60.33,49.53 74.3,49.53 77.47,52.7 v83.19,52.7 | v81.92,59.69 81.92,57.78 v83.19,56.52
VREF1
  Top 0.406: BUF1.6 27.3,31.11 26.04,29.84 | 26.04,29.84 BUF1.2 26.04,24.13 27.94,22.23 38.73,22.23 39.37,22.86 39.37,23.5 AMP1.2 | 26.04,29.84 24.77,29.84 20.95,25.4 18.41,25.4 BUF2.2 18.41,30.48 19.68,31.75 BUF2.6 19.68,36.83 6.99,36.83 6.99,66.04 9.53,68.58 21.59,68.58 22.23,69.22 22.23,69.7 X2.2
VREF2  (via drill 0.6)
  Top 0.406: 17.14,52.07 20.95,50.16 BUF3.6 20.95,43.18 19.68,41.91 BUF3.2 19.68,38.1 22.23,36.83 27.94,36.83 27.94,35.56 31.75,35.56 AMP2.2 | 17.14,52.07 15.24,52.07 14.61,51.44 BUF4.6 14.61,46.99 13.34,45.72 BUF4.2 | 17.14,52.07 v17.14,55.88 | v17.14,60.33 17.78,60.33 31.75,74.3 31.75,75.56 33.66,77.47 X2.23
  Bottom 0.406: v17.14,55.88 v17.14,60.33
VREF3
  Top 0.406: AMP3.2 39.37,50.8 40.64,48.26 27.94,48.26 27.94,52.07 25.4,54.61 24.77,54.61 24.13,55.24 | X2.7 41.27,74.91 41.27,67.31 40.64,66.67 36.2,66.67 32.87,63.35 BUF5.6 32.61,63.09 31.11,61.59 29.58,61.59 BUF5.2 27.94,59.95 26.67,59.69 24.13,59.69 BUF6.6 24.13,55.24 | 24.13,55.24 22.86,53.98 BUF6.2
VREF4
  Top 0.406: BUF8.6 74.93,33.66 73.66,32.38 BUF8.2 73.66,26.04 71.12,23.5 | BUF7.6 66.41,20.95 66.67,20.95 | 66.67,20.95 68.21,20.95 BUF7.2 70.08,22.45 71.12,23.5 | AMP4.2 64.77,22.86 66.67,20.95 | 71.12,23.5 74.93,19.68 85.09,19.68 90.17,23.5 90.17,70.48 77.47,70.48 75.56,72.39 61.91,72.39 61.91,77.19 X2.33
VREF5  (via drill 0.6)
  Top 0.406: BUF10.6 84.45,38.1 v83.19,37.47 BUF10.2 | AMP5.2 77.47,38.1 | 77.47,38.1 78.74,39.37 BUF9.2 78.74,46.99 80.01,48.26 BUF9.6 80.01,50.8 81.92,51.44 81.92,57.15 83.19,59.05 83.19,65.41 74.93,65.41 74.3,66.04 73.66,67.31 71.75,69.22 57.78,69.22 55.24,71.75 55.24,74.73 X2.12 | v78.11,37.47 77.47,38.1
  Bottom 0.406: v83.19,37.47 v78.11,37.47
VREF6  (via drill 0.6)
  Top 0.406: BUF12.6 78.11,59.05 76.83,57.78 v76.83,57.15 BUF12.2 76.83,54.61 75.56,53.34 71.75,53.34 69.22,50.8 AMP6.2 | v73.03,59.05 71.61,60.47 BUF11.2 71.35,60.73 69.85,62.23 69.85,63.76 BUF11.6 67.57,66.04 v66.67,66.67 | X2.28 48.16,64.87 62.76,64.87 v63.5,64.14
  Bottom 0.406: v73.03,59.05 v76.83,57.15 | v63.5,64.14 61.59,66.04 64.77,68.58 v66.67,66.67